# EAGLE design SparkFun_ADMP401-Breakout (EAGLE 7.2.0)
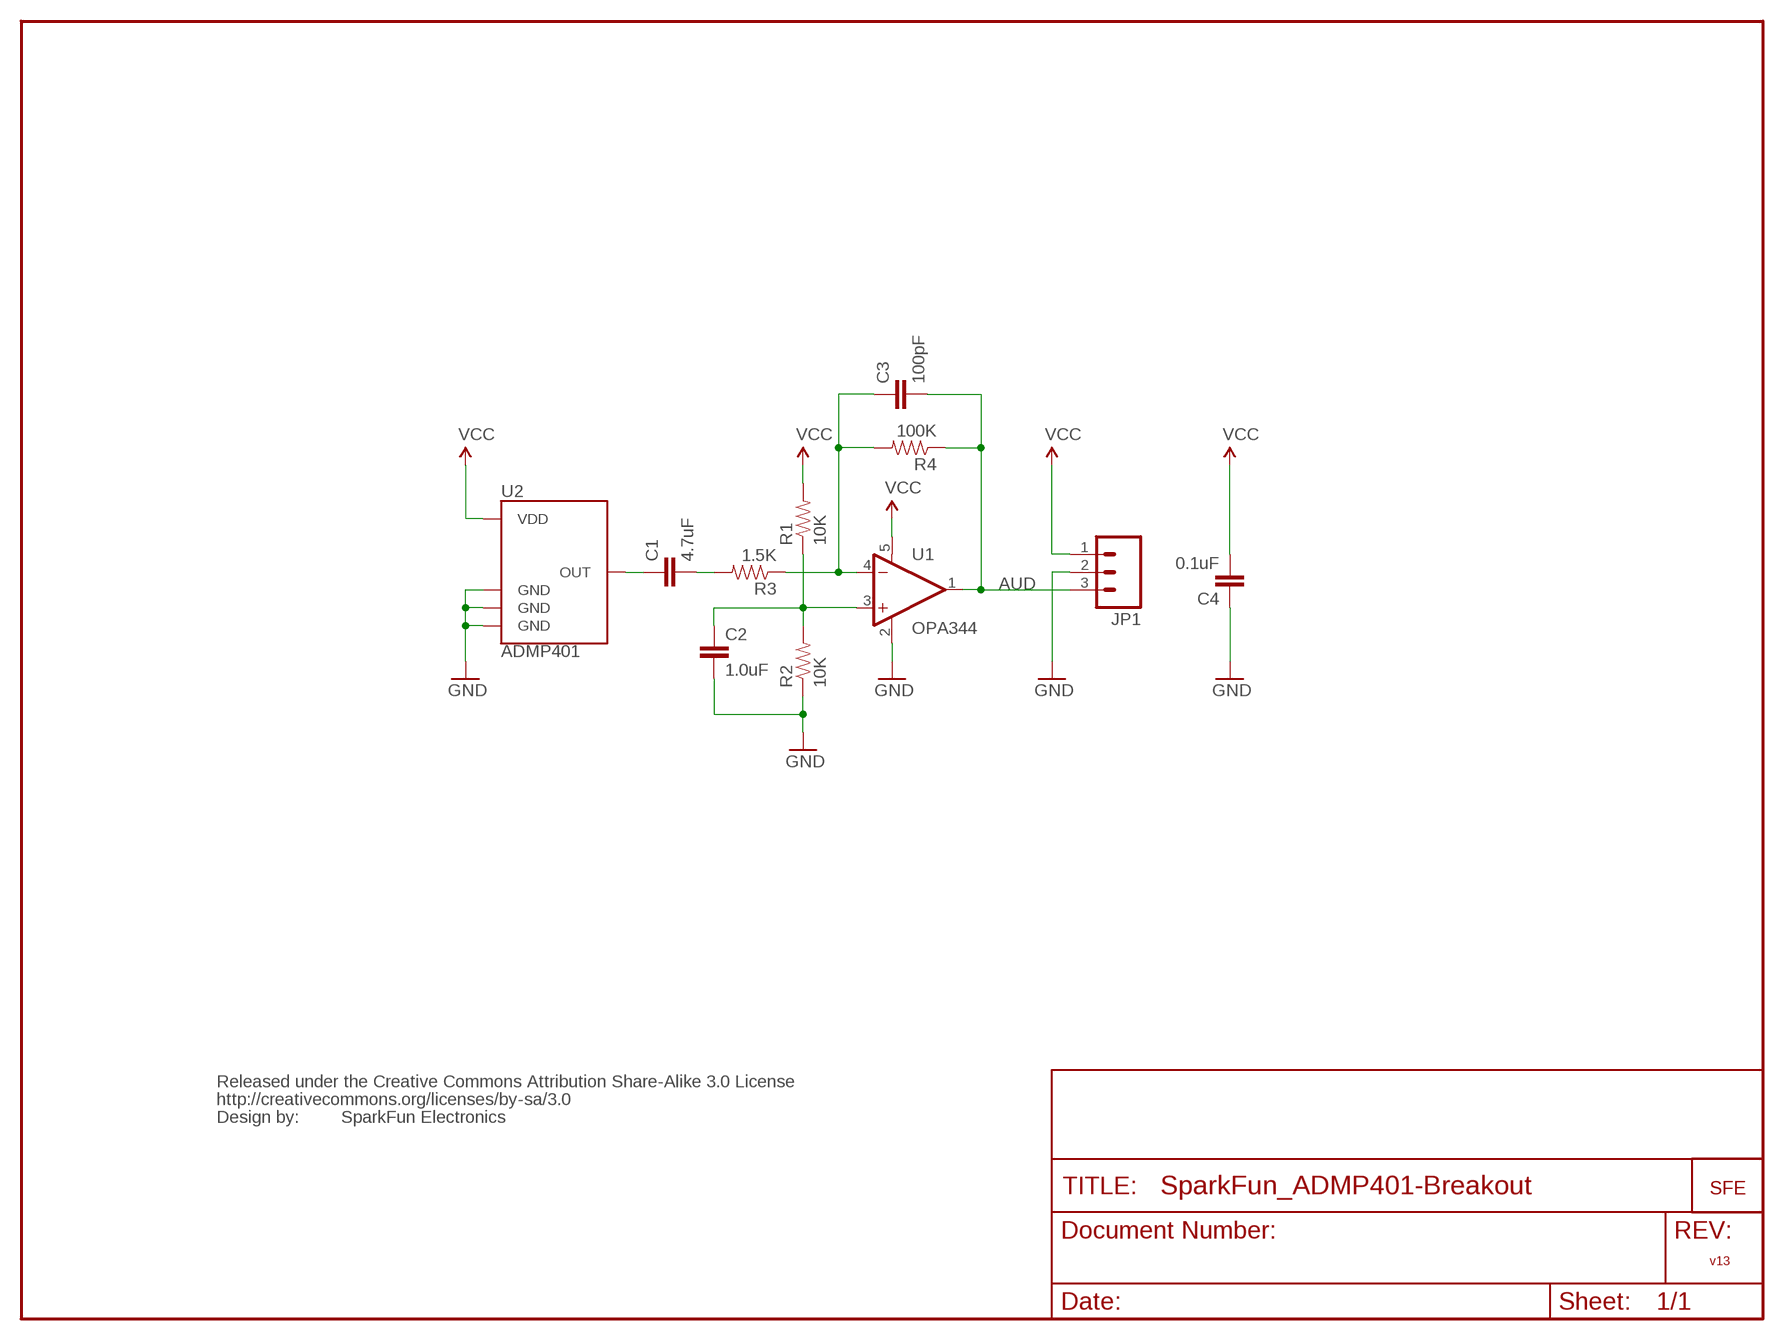
[diagram p0: schematic, sheet 1]

## Parts
C1  4.7uF  CAP0402-CAP  [0402-CAP]
C2  1.0uF  CAP0402-CAP  [0402-CAP]
C3  100pF  CAP0402-CAP  [0402-CAP]
C4  0.1uF  CAP0402-CAP  [0402-CAP]
JP1  M03PTH  [1X03]
R1  10K  RESISTOR0402-RES  [0402-RES]
R2  10K  RESISTOR0402-RES  [0402-RES]
R3  1.5K  RESISTOR0402-RES  [0402-RES]
R4  100K  RESISTOR0402-RES  [0402-RES]
U1  OPA344  [SOT23-5]
U2  ADMP401  [ADMP401]
U$1  LOGO-SFESK  [SFE-LOGO-FLAME]
U$2  CREATIVE_COMMONS  [CREATIVE_COMMONS]

## Nets
AUD: C3.2 JP1.3 R4.1 U1.1(OUT)
GND: C2.2 C4.1 JP1.2 R2.1 U1.2(V-) U2.2(GND) U2.4(GND) U2.6(GND)
N$1: C1.1 U2.1(OUT)
N$2: C3.1 R3.1 R4.2 U1.4(-IN)
N$6: C1.2 R3.2
N$7: C2.1 R1.1 R2.2 U1.3(+IN)
VCC: C4.2 JP1.1 R1.2 U1.5(V+) U2.5(VDD)

## Notes on the sheet
- SparkFun Electronics
- v13

## Library data of the parts
C1-C4 = SparkFun:CAP: Capacitor Standard 0603 ceramic capacitor, and 0.1" leaded capacitor.
JP1 = SparkFun:M03: Header 3 Standard 3-pin 0.1" header. Use with straight break away headers (SKU : PRT-00116), right angle break away headers (PRT-00553), swiss pins (PRT-00743), machine pins (PRT-00117), and female headers (PRT-00115). Molex polarized connector foot print use with SKU : PRT-08232 with associated crimp pins and housings.
R1-R4 = SparkFun:RESISTOR: Resistor Basic schematic elements and footprints for 0603, 1206, and PTH 1/10th watt (small) resistors.
U1 = SparkFun:OPA344
U2 = SparkFun:ADMP401
U$1 = SparkFun:LOGO-SFE: Spark Fun Electronics PCB Logo This is the standard Spark Fun Electronics PCB logo.
U$2 = SparkFun:CREATIVE_COMMONS

## Board
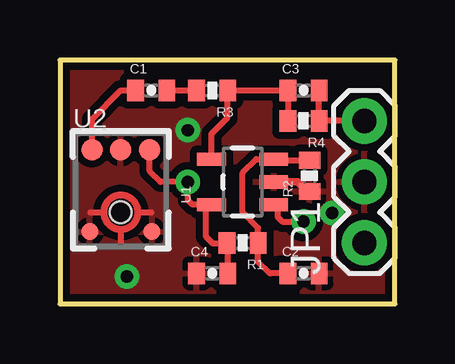
[diagram p1: board, top side]
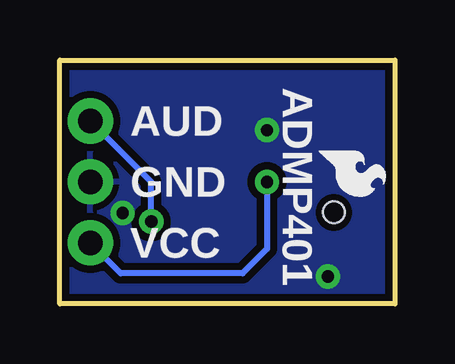
[diagram p2: board, bottom side, seen from below]

Size 13.97 x 10.16 mm. Coordinates in mm from the lower left corner, seen from the top.
Outline: 0,0 13.97,0 13.97,10.16 0,10.16 0,0
Copper layers (1*16): Top 0.035mm / dielectric 1.5mm / Bottom 0.035mm
Design rules "SparkFun": minimum track width 8mil, minimum drill 20mil, track to track 8mil, track to pad 8mil, pad to pad 8mil, via to via 8mil, smd to smd 8mil, copper to edge 9mil, drill to drill 8mil, minimum pad ring 12mil, minimum via ring 10mil, stop-mask expansion 4mil, vias tented up to drill 20mil, thermal gap 10mil

### Footprints (pad centres in the part's own frame; a part is rotated, then mirrored left to right if it is on the bottom)
0402-CAP = smd 0.7 x 0.9: 1 -0.65,0; 2 0.65,0
1X03 = drill 1.016 pad 1.88: 1 0,0; 2 2.54,0; 3 5.08,0
0402-RES = smd 0.7 x 0.9: 1 -0.65,0; 2 0.65,0
SOT23-5 = smd 0.55 x 1.2: 1 -0.95,-1.3; 2 0,-1.3; 3 0.95,-1.3; 4 0.95,1.3; 5 -0.95,1.3
ADMP401 = smd 0.9 x 0.9: 1 -1.2,2.62; 5 1.2,2.62; 6 0,2.62 | smd 0.7 x 0.7: 2 1.3,-0.8; 4 -1.3,-0.8 | hole 0.9: 0,0

### Placement (x,y rotation side)
C1  3.81,8.89 0 top
C2  10.16,1.27 0 top
C3  10.16,8.89 0 top
C4  6.35,1.27 0 top
JP1  12.7,2.54 90 top
R1  7.62,2.54 180 top
R2  10.41,5.33 90 top
R3  6.35,8.89 180 top
R4  10.16,7.62 180 top
U1  7.62,5.08 90 top
U2  2.54,3.81 0 top
U$1  3.17,6.35 270 bottom
U$2  20.32,-10.16 0 top  (outside the outline)

### Tracks (layer width: path | path; a pad name or v marks a point on that pad's centre or on a via)
AUD  (via drill 0.51)
  Top 0.254: C3.2 R4.1 JP1.3 | U1.1 9.08,4.13 9.08,3.62 9.27,3.43 v10.16,3.43
  Bottom 0.254: v10.16,3.43 10.16,5.08 JP1.3
GND  (via drill 0.51)
  Top 0.254: 2.54,3 2.54,2.54 | 1.27,3.81 1.73,3.81 | 3.35,3.81 3.81,3.81
  Top 0.305: U1.2 9.91,5.08 10.3,4.68 R2.1
  other vias: 11.35,3.78 2.79,1.14 5.33,7.24
  pour Bottom (isolate 0.305): 0,0 0,10.16 13.97,10.16 13.97,0
  pour Top (isolate 0.305): 0,0 0,10.16 13.97,10.16 13.97,0
N$1
  Top 0.254: C1.1 2.54,8.89 1.34,7.69 U2.1
N$2
  Top 0.254: R3.1 C3.1 | R3.1 C3.1 | C3.1 R4.2 | U1.4 6.32,7.08 6.99,7.75 6.99,8.88 R3.1
N$6
  Top 0.254: C1.2 R3.2
N$7
  Top 0.254: R2.2 8.97,5.98 U1.3 | U1.3 8.89,6.06 | U1.3 8.19,6.03 7.62,5.46 7.62,3.81 8.27,3.16 R1.1 8.27,1.76 8.76,1.27 C2.1
VCC  (via drill 0.51)
  Top 0.254: C4.2 7,2.51 | 7,2.51 R1.2 | 7,2.51 6.38,2.51 6.1,2.79 6.1,3.91 U1.5 5.52,4.13 5.33,4.32 v5.33,5.08 4.19,5.08 3.74,5.53 U2.5
  Bottom 0.254: JP1.1 11.43,1.27 6.35,1.27 5.33,2.29 v5.33,5.08

### Text on the board
bPlace: ADMP401 | AUD | GND | VCC
tValues: DNP | Mic Breakout